# EAGLE design step_motor (EAGLE 6.5.0)

## Sheet 1 of 3: Encoder, connectors and supply
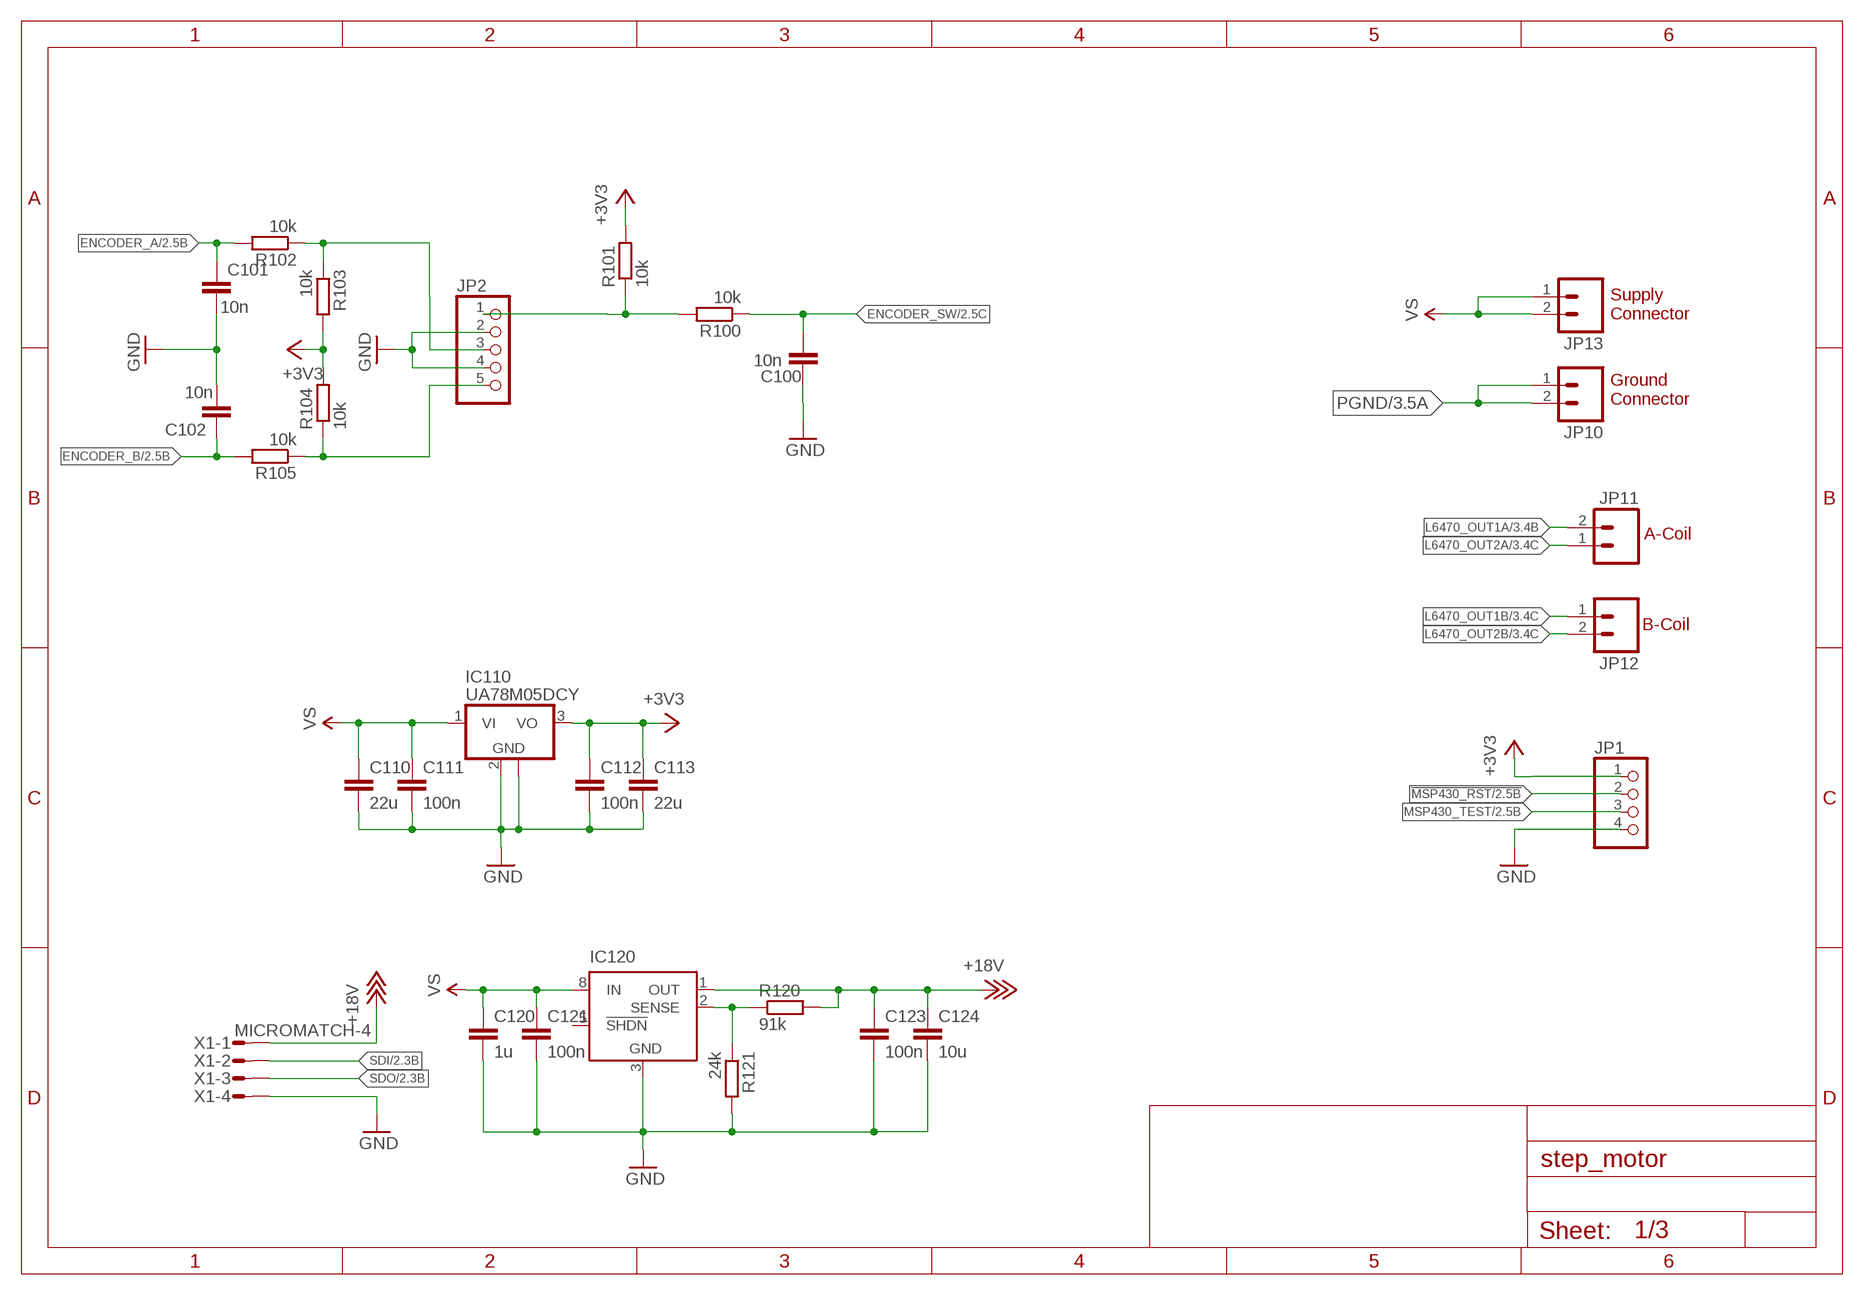
[diagram p0: schematic, sheet 1]

### Parts
C100  10n  C-EUC0603  [C0603]
C101  10n  C-EUC0603  [C0603]
C102  10n  C-EUC0603  [C0603]
C110  22u  C-EUC1206  [C1206]
C111  100n  C-EUC0603  [C0603]
C112  100n  C-EUC0603  [C0603]
C113  22u  C-EUC1206  [C1206]
C120  1u  C-EUC1206  [C1206]
C121  100n  C-EUC0603  [C0603]
C123  100n  C-EUC0603  [C0603]
C124  10u  C-EUC1206  [C1206]
IC110  UA78M05DCY  [SOT223]
IC120  LT1129CS8  [SOIC8]
JP1  PINHD-1X4  [1X04]
JP2  PINHD-1X5  [1X05]
JP10  M023.5MM  [SCREWTERMINAL-3.5MM-2]
JP11  M023.5MM  [SCREWTERMINAL-3.5MM-2]
JP12  M023.5MM  [SCREWTERMINAL-3.5MM-2]
JP13  M023.5MM  [SCREWTERMINAL-3.5MM-2]
R100  10k  R-EU_R0603  [R0603]
R101  10k  R-EU_R0603  [R0603]
R102  10k  R-EU_R0603  [R0603]
R103  10k  R-EU_R0603  [R0603]
R104  10k  R-EU_R0603  [R0603]
R105  10k  R-EU_R0603  [R0603]
R120  91k  R-EU_R0603  [R0603]
R121  24k  R-EU_R0603  [R0603]
X1  MICROMATCH-4  [MICROMATCH-4]

### Nets
!MSP430_RST: JP1.2 ; also sheet 2
+3V3: C112.1 C113.1 IC110.3(VO) JP1.1 R101.2 R103.2 R104.2 ; also sheet 2,3
+18V: C123.1 C124.1 IC120.1(OUT) R120.2 X1.1
ENCODER_A: C101.1 R102.2 ; also sheet 2
ENCODER_B: C102.1 R105.2 ; also sheet 2
ENCODER_SW: C100.2 R100.1 ; also sheet 2
GND: C100.1 C101.2 C102.2 C110.2 C111.2 C112.2 C113.2 C120.2 C121.2 C123.2 C124.2 IC110.2(GND) IC110.4(GND) IC120.3(GND) JP1.4 JP2.2 JP2.4 R121.2 X1.4 ; also sheet 2,3
L6470_OUT1A: JP11.2 ; also sheet 3
L6470_OUT1B: JP12.1 ; also sheet 3
L6470_OUT2A: JP11.1 ; also sheet 3
L6470_OUT2B: JP12.2 ; also sheet 3
MSP430_TEST: JP1.3 ; also sheet 2
N$2: IC120.2(SENSE) R120.1 R121.1
N$33: JP2.3 R102.1 R103.1
N$36: JP2.1 R100.2 R101.1
PGND: JP10.1 JP10.2 ; also sheet 3
R904: JP2.5 R104.1 R105.1
SDI: X1.2 ; also sheet 2
SDO: X1.3 ; also sheet 2
VS: C110.1 C111.1 C120.1 C121.1 IC110.1(VI) IC120.8(IN) JP13.1 JP13.2 ; also sheet 3
Unconnected: IC120.4(NC) IC120.5(!SHDN)

### Notes on the sheet
- Supply
  Connector
- Ground
  Connector
- A-Coil
- B-Coil

## Sheet 2 of 3: Mikrocontroller MSP430G2553
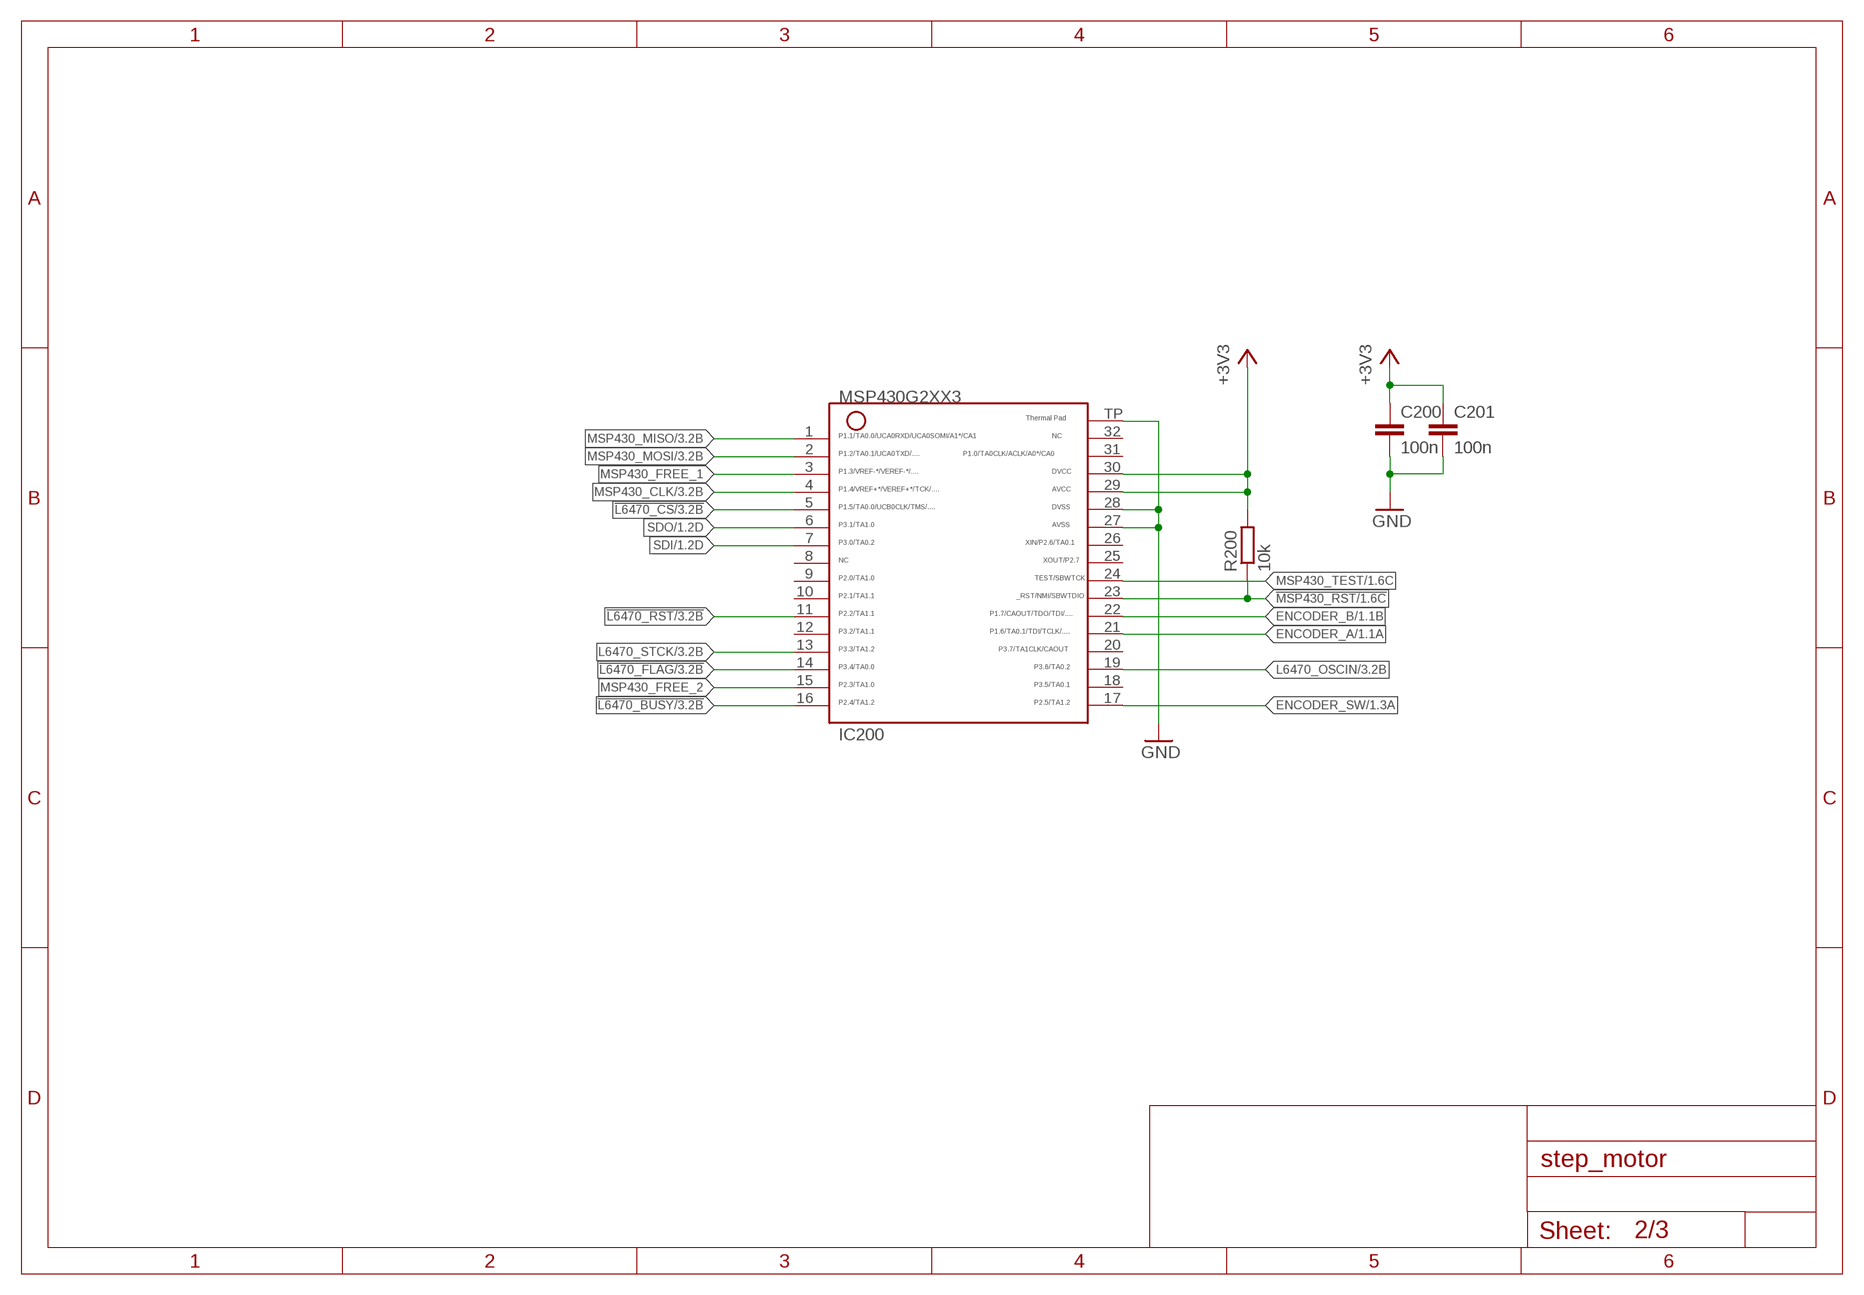
[diagram p1: schematic, sheet 2]

### Parts
C200  100n  C-EUC0603  [C0603]
C201  100n  C-EUC0603  [C0603]
IC200  G2XX3---RHB32  [RHB32]
R200  10k  R-EU_R0603  [R0603]

### Nets
!L6470_BUSY: IC200.16 ; also sheet 3
!L6470_CS: IC200.5 ; also sheet 3
!L6470_FLAG: IC200.14 ; also sheet 3
!L6470_RST: IC200.11 ; also sheet 3
!MSP430_RST: IC200.23 R200.1 ; also sheet 1
+3V3: C200.1 C201.1 IC200.29 IC200.30 R200.2 ; also sheet 1,3
ENCODER_A: IC200.21 ; also sheet 1
ENCODER_B: IC200.22 ; also sheet 1
ENCODER_SW: IC200.17 ; also sheet 1
GND: C200.2 C201.2 IC200.27 IC200.28 IC200.TP ; also sheet 1,3
L6470_OSCIN: IC200.19 ; also sheet 3
L6470_STCK: IC200.13 ; also sheet 3
MSP430_CLK: IC200.4 ; also sheet 3
MSP430_FREE_1: IC200.3
MSP430_FREE_2: IC200.15
MSP430_MISO: IC200.1 ; also sheet 3
MSP430_MOSI: IC200.2 ; also sheet 3
MSP430_TEST: IC200.24 ; also sheet 1
SDI: IC200.7 ; also sheet 1
SDO: IC200.6 ; also sheet 1
Unconnected: IC200.8 IC200.9 IC200.10 IC200.12 IC200.18 IC200.20 IC200.25 IC200.26 IC200.31 IC200.32

## Sheet 3 of 3: Step motor driver L6470 Datasheet <http://www.st.com/st-web-ui/static/active/en/resource/technical/document/datasheet/CD00255075.pdf>
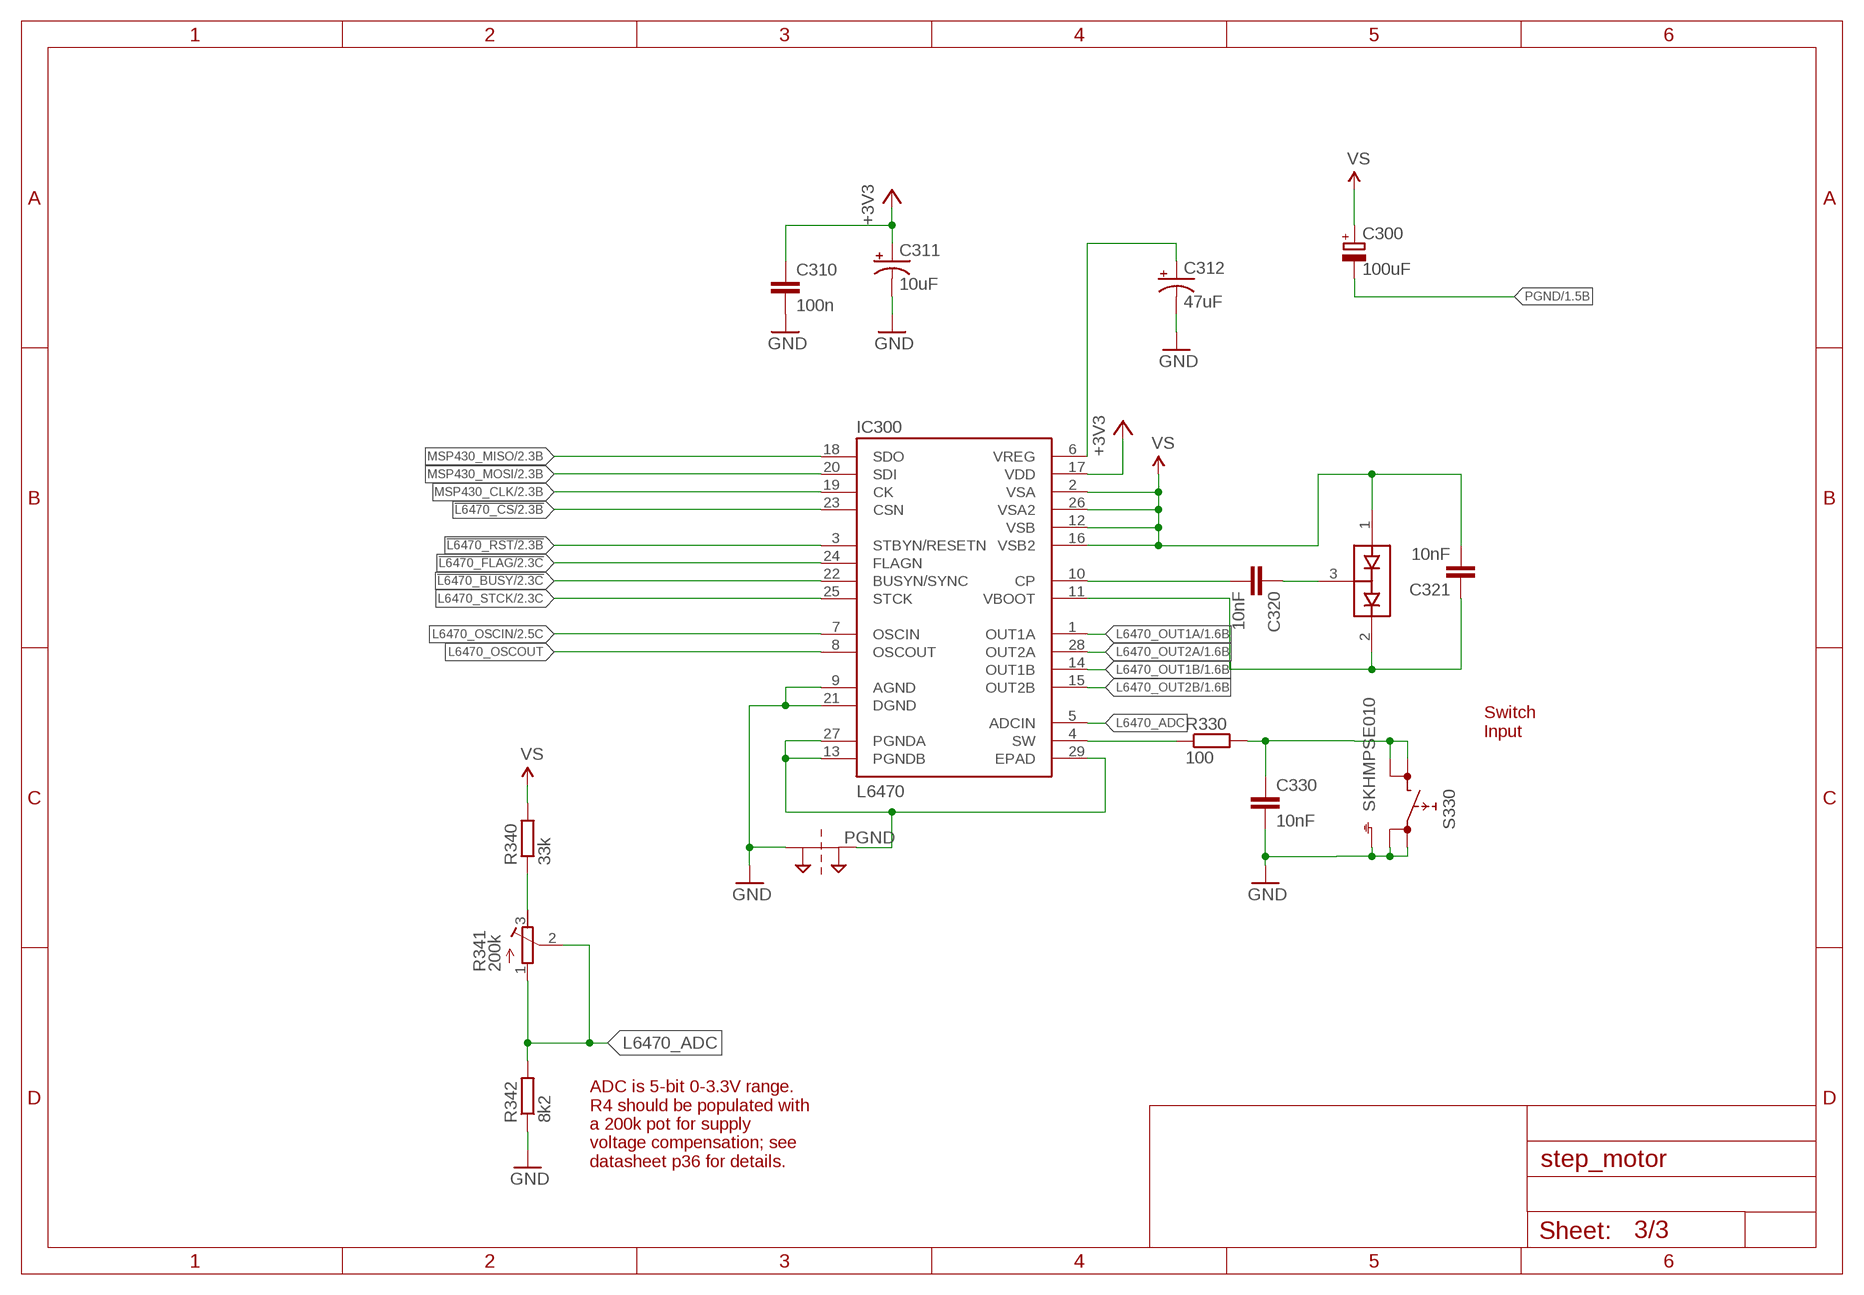
[diagram p2: schematic, sheet 3]

### Parts
C300  100uF  CPOL-EUD  [PANASONIC_D]
C310  100n  C-EUC0603  [C0603]
C311  10uF  10UF-TANT  [EIA3216]
C312  47uF  47UF-TANT  [EIA3528]
C320  10nF  C-EUC0603  [C0603]
C321  10nF  C-EUC0603  [C0603]
C330  10nF  C-EUC0603  [C0603]
D320  BAV99  [SOT23]
IC300  L6470  L6470  [HTSSOP28]
R330  100  R-EU_R0603  [R0603]
R340  33k  R-EU_R0603  [R0603]
R341  200k  R-TRIMM3224X  [RTRIM3224X]
R342  8k2  R-EU_R0603  [R0603]
S330  SKHMPSE010  [SKHMPXE010]
SJ2  2PT_GND_TIE  [2PT_GND_TIE]

### Nets
!L6470_BUSY: IC300.22(BUSYN/SYNC) ; also sheet 2
!L6470_CS: IC300.23(CSN) ; also sheet 2
!L6470_FLAG: IC300.24(FLAGN) ; also sheet 2
!L6470_RST: IC300.3(STBYN/RESETN) ; also sheet 2
+3V3: C310.1 C311.A(+) IC300.17(VDD) ; also sheet 1,2
C320: C320.2 IC300.10(CP)
GND: C310.2 C311.C(-) C312.C(-) C330.2 IC300.9(AGND) IC300.21(DGND) R342.1 S330.1(1.1) S330.2(1.2) S330.5(SH) SJ2.P$1 ; also sheet 1,2
L6470_ADC: IC300.5(ADCIN) R341.1(A) R341.2(S) R342.2
L6470_OSCIN: IC300.7(OSCIN) ; also sheet 2
L6470_OSCOUT: IC300.8(OSCOUT)
L6470_OUT1A: IC300.1(OUT1A) ; also sheet 1
L6470_OUT1B: IC300.14(OUT1B) ; also sheet 1
L6470_OUT2A: IC300.28(OUT2A) ; also sheet 1
L6470_OUT2B: IC300.15(OUT2B) ; also sheet 1
L6470_STCK: IC300.25(STCK) ; also sheet 2
MSP430_CLK: IC300.19(CK) ; also sheet 2
MSP430_MISO: IC300.18(SDO) ; also sheet 2
MSP430_MOSI: IC300.20(SDI) ; also sheet 2
N$1: C312.A(+) IC300.6(VREG)
N$5: IC300.4(SW) R330.1
N$6: C330.1 R330.2 S330.3(2.1) S330.4(2.2)
N$8: C320.1 D320.3(COM)
N$9: C321.1 D320.2(C2) IC300.11(VBOOT)
N$11: R340.1 R341.3(E)
PGND: C300.- IC300.13(PGNDB) IC300.27(PGNDA) IC300.29(EPAD) SJ2.P$2 ; also sheet 1
VS: C300.+ C321.2 D320.1(A1) IC300.2(VSA) IC300.12(VSB) IC300.16(VSB2) IC300.26(VSA2) R340.2 ; also sheet 1

### Notes on the sheet
- Switch
  Input
- ADC is 5-bit 0-3.3V range.
  R4 should be populated with
  a 200k pot for supply
  voltage compensation; see
  datasheet p36 for details.

## Power pins joined to a net without a drawn wire
GND: IC120.6(GND) IC120.7(GND)

## Library data of the parts
C100-C102 C110-C113 C120 C121 C123 C124 C200 C201 C310 C320 C321 C330 = rcl:C-EU: CAPACITOR, European symbol
C300 = rcl:CPOL-EU: POLARIZED CAPACITOR, European symbol
C311 = SparkFun-Capacitors:10UF-TANT: 10uF Tantalum SMT CAP-00811- 16V 10% (EIA-3216); PROD_ID: CAP-00811
C312 = SparkFun-Capacitors:47UF-TANT: 47uF Tantalum SMT CAP-08310- 10V 10% (EIA-3528); PROD_ID: CAP-08310
D320 = SparkFun-DiscreteSemi:BAV99: Two small signal silicon diodes connected anode to cathode. Connections to all three nodes available. DIO-10647; PROD_ID: DIO-10647
IC110 = linear:UA78M*: POSITIVE-VOLTAGE REGULATORS Source: http://focus.ti.com/lit/ds/symlink/ua78m33.pdf
IC120 = linear-technology:LT1129CS8: VOLTAGE REGULATOR with shutdown; MPN: LT1129CS8-5#PBF; OC_FARNELL: 1273576; OC_NEWARK: 57M2078
IC200 = TI_MSP430_v16:G2XX3---RHB32: MSP430G2XX1 QFN (RHB) 32 Pin Package
IC300 = SparkFun-PowerIC:L6470: 3A RMS/7A peak bipolar stepper motor driver with SPI control and step input in HTSSOP-28 package. IC-10648; PROD_ID: IC-10648
JP1 = pinhead:PINHD-1X4: PIN HEADER
JP2 = pinhead:PINHD-1X5: PIN HEADER
JP10-JP13 = SparkFun:M02: Header 2 Standard 2-pin 0.1" header. Use with straight break away headers (SKU : PRT-00116), right angle break away headers (PRT-00553), swiss pins (PRT-00743), machine pins (PRT-00117), and female headers (PRT-00115). Molex polarized connector foot print use with SKU : PRT-08233 with associated crimp pins and housings.
R100-R105 R120 R121 R200 R330 R340 R342 = rcl:R-EU_: RESISTOR, European symbol
R341 = rcl:R-TRIMM: Trimm resistor
S330 = switch:SKHMP*E010: 6.2 X 6.5mm TACT Switch (SMD) Source: http://www3.alps.co.jp/WebObjects/catalog.woa/PDF/E/Switch/Tact/SKHM/SKHM.PDF
SJ2 = SparkFun-Passives:2PT_GND_TIE: Package for connecting two ground nets in one place.
X1 = con-amp-micromatch:MICROMATCH-4: MicroMaTch 4 7-215464-4 / 0-215464-4 Drawing Number C-215464 DDEController.pdf; MPN: 7-215464-4; OC_FARNELL: 3784629; OC_NEWARK: 19R8124

## Board
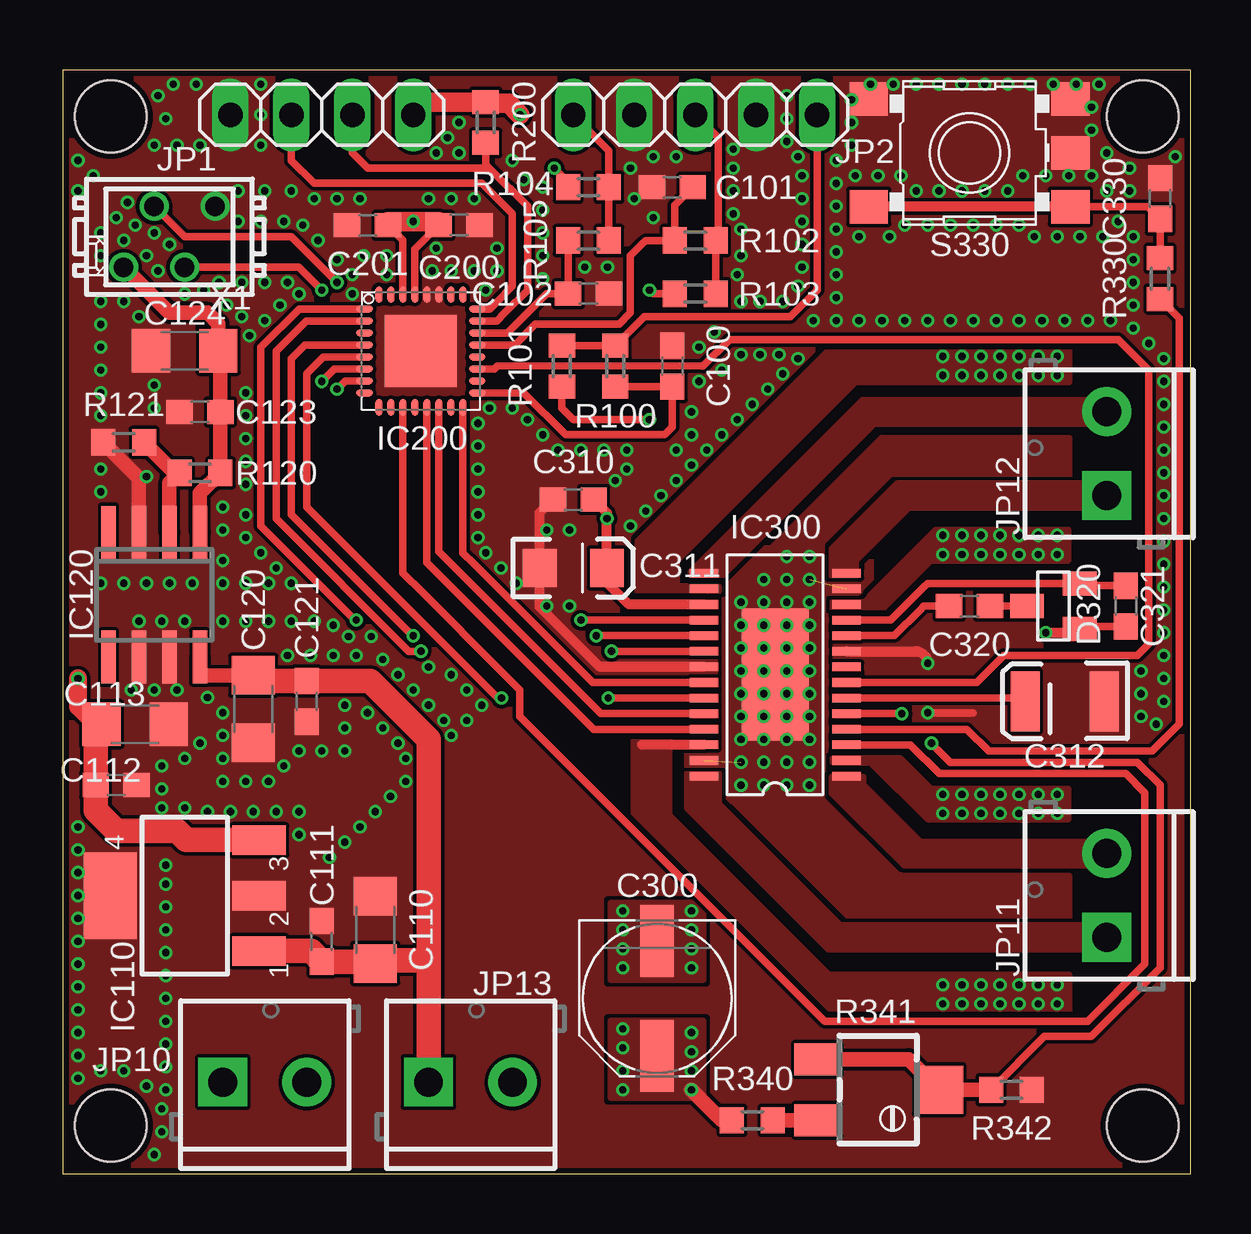
[diagram p3: board, top side]
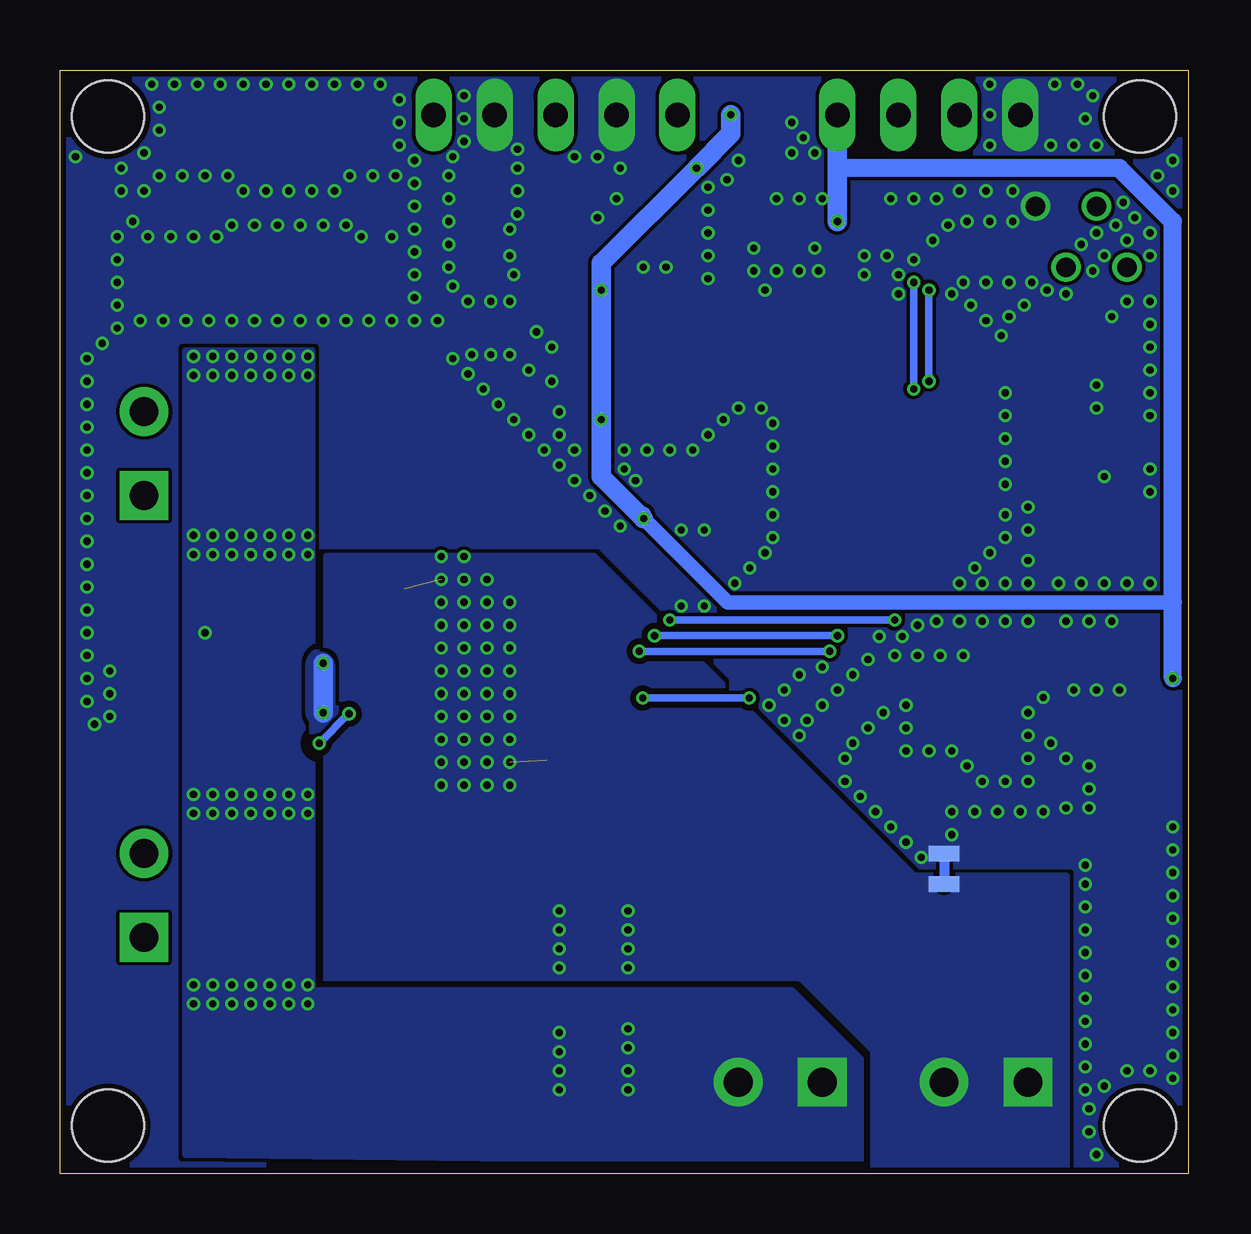
[diagram p4: board, bottom side, seen from below]

Size 47 x 46 mm. Coordinates in mm from the lower left corner, seen from the top.
Outline: 0,0 47,0 47,46 0,46 0,0
Copper layers (1*16): Top 0.018mm / dielectric 1.55mm / Bottom 0.018mm
Design rules "eC_2Layer_PClass6_BaseCopperO18_eCDefault *": minimum track width 0.15mm, minimum drill 0.3mm, track to track 0.15mm, track to pad 0.15mm, pad to pad 0.15mm, via to via 0.15mm, smd to smd 0mil, copper to edge 0.25mm, drill to drill 0.35mm, minimum pad ring 0.175mm, minimum via ring 0.125mm, stop-mask expansion 0mil, vias tented up to drill 0.45mm, thermal gap 0.2mm
Holes 3 mm at 45,44.06 45,2 2,44.06 2,2

### Footprints (pad centres in the part's own frame; a part is rotated, then mirrored left to right if it is on the bottom)
C0603 = smd 1.1 x 1: 1 -0.85,0; 2 0.85,0
C1206 = smd 1.6 x 1.8: 1 -1.4,0; 2 1.4,0
PANASONIC_D = smd 3 x 1.4: + 2.4,0; - -2.4,0
EIA3216 = smd 1.4 x 1.6: A 1.4,0; C -1.4,0
EIA3528 = smd 1.2 x 2.5: A 1.65,0; C -1.65,0
SOT23 = smd 1 x 1.4: 1 -0.95,-1.1; 2 0.95,-1.1; 3 0,1.1
SOT223 = smd 1.219 x 2.235: 1 -2.311,-3.099; 2 0,-3.099; 3 2.311,-3.099 | smd 3.6 x 2.2: 4 0,3.099
SOIC8 = smd 0.6 x 2.2: 1 -1.905,-2.6; 2 -0.635,-2.6; 3 0.635,-2.6; 4 1.905,-2.6; 5 1.905,2.6; 6 0.635,2.6; 7 -0.635,2.6; 8 -1.905,2.6
RHB32 = smd 0.7 x 0.3: 1 -2.35,1.75; 2 -2.35,1.25; 3 -2.35,0.75; 4 -2.35,0.25; 5 -2.35,-0.25; 6 -2.35,-0.75; 7 -2.35,-1.25; 8 -2.35,-1.75; 17 2.35,-1.75; 18 2.35,-1.25; 19 2.35,-0.75; 20 2.35,-0.25; 21 2.35,0.25; 22 2.35,0.75; 23 2.35,1.25; 24 2.35,1.75 | smd 0.3 x 0.7: 9 -1.75,-2.35; 10 -1.25,-2.35; 11 -0.75,-2.35; 12 -0.25,-2.35; 13 0.25,-2.35; 14 0.75,-2.35; 15 1.25,-2.35; 16 1.75,-2.35; 25 1.75,2.35; 26 1.25,2.35; 27 0.75,2.35; 28 0.25,2.35; 29 -0.25,2.35; 30 -0.75,2.35; 31 -1.25,2.35; 32 -1.75,2.35 | smd 3 x 3: TP 0,0
HTSSOP28 = smd 0.36 x 1.19: 1 -4.225,-2.97; 2 -3.575,-2.97; 3 -2.925,-2.97; 4 -2.275,-2.97; 5 -1.625,-2.97; 6 -0.975,-2.97; 7 -0.325,-2.97; 8 0.325,-2.97; 9 0.975,-2.97; 10 1.625,-2.97; 11 2.275,-2.97; 12 2.925,-2.97; 13 3.575,-2.97; 14 4.225,-2.97; 15 4.225,2.97; 16 3.575,2.97; 17 2.925,2.97; 18 2.275,2.97; 19 1.625,2.97; 20 0.975,2.97; 21 0.325,2.97; 22 -0.325,2.97; 23 -0.975,2.97; 24 -1.625,2.97; 25 -2.275,2.97; 26 -2.925,2.97; 27 -3.575,2.97; 28 -4.225,2.97 | smd 5.5 x 2.8: 29 0,0
1X04 = drill 1.016 long: 1 -3.81,0; 2 -1.27,0; 3 1.27,0; 4 3.81,0
1X05 = drill 1.016 long: 1 -5.08,0; 2 -2.54,0; 3 0,0; 4 2.54,0; 5 5.08,0
SCREWTERMINAL-3.5MM-2 = drill 1.2 pad 2.032 square: 1 0,0 | drill 1.2 pad 2.032: 2 3.5,0
R0603 = smd 1 x 1.1: 1 -0.85,0; 2 0.85,0
RTRIM3224X = smd 1.32 x 1.9: 1 -1.27,-2.54; 3 1.27,-2.54 | smd 2 x 2: 2 0,2.54
SKHMPXE010 = smd 1.6 x 1.4: 1 -4.2,2.25; 2 4.2,2.25; 3 -4.2,-2.25; 4 4.2,-2.25; 5 4.2,0
2PT_GND_TIE = smd 1.27 x 0.635: P$1 0,0.635; P$2 0,-0.635
MICROMATCH-4 = drill 0.813: 1 1.905,1.27; 2 0.635,-1.27; 3 -0.635,1.27; 4 -1.905,-1.27

### Placement (x,y rotation side)
C100  25.4,33.66 270 top
C101  25.4,41.12 180 top
C102  21.91,36.67 0 top
C110  13.02,10.16 90 top
C111  10.79,9.68 90 top
C112  2.22,16.19 0 top
C113  3.02,18.73 0 top
C120  7.94,19.37 270 top
C121  10.16,19.68 270 top
C123  5.71,31.75 180 top
C124  5.08,34.29 180 top
C200  16.51,39.53 0 top
C201  12.7,39.53 180 top
C300  24.77,7.3 270 top
C310  21.27,28.1 180 top
C311  21.27,25.24 0 top
C312  41.75,19.68 180 top
C320  37.78,23.65 180 top
C321  44.29,23.65 270 top
C330  45.72,40.64 90 top
D320  41.27,23.65 90 top
IC110  5.08,11.59 90 top
IC120  3.81,24.13 180 top
IC200  14.92,34.29 0 top
IC300  29.69,20.8 90 top
JP1  10.79,44.13 180 top
JP2  26.35,44.13 180 top
JP10  6.67,3.81 0 top
JP11  43.5,9.84 90 top
JP12  43.5,28.26 90 top
JP13  15.24,3.81 0 top
R100  23.02,33.66 90 top
R101  20.8,33.66 270 top
R102  26.35,38.89 180 top
R103  26.35,36.67 180 top
R104  21.91,41.12 180 top
R105  21.91,38.89 180 top
R120  5.71,29.21 0 top
R121  2.54,30.48 180 top
R200  17.62,43.81 90 top
R330  45.72,37.31 90 top
R340  28.73,2.22 180 top
R341  33.97,3.49 270 top
R342  39.53,3.49 180 top
S330  37.78,42.55 0 top
SJ2  10.16,12.7 0 bottom
X1  4.45,39.05 180 top

### Tracks (layer width: path | path; a pad name or v marks a point on that pad's centre or on a via)
!L6470_BUSY
  Top 0.305: IC300.22 22.07,20.47 17.14,25.4 16.67,25.87 IC200.16
!L6470_CS  (via drill 0.3)
  Top 0.305: IC300.23 v22.72,19.82 | IC200.5 10.86,34.04 10.16,33.34 10.16,27.78 18.12,19.82 v18.28,19.82
  Bottom 0.305: v22.72,19.82 v18.28,19.82
!L6470_FLAG
  Top 0.305: IC300.24 22.42,19.17 16.19,25.4 15.67,25.92 IC200.14
!L6470_RST
  Top 0.305: IC200.11 14.17,25.04 14.99,24.22 18.26,20.95 19.05,20.16 19.05,19.05 31.75,6.35 42.7,6.35 45.09,8.73 45.09,15.88 44.29,16.67 36.51,16.67 35.31,17.87 IC300.3
!MSP430_RST
  Top 0.305: JP1.2 12.06,42.55 12.7,41.91 17.78,41.91 | 17.78,41.91 19.37,40.32 19.37,36.83 18.41,35.88 18.08,35.54 IC200.23 | R200.1 17.62,42.07 17.78,41.91
+3V3  (via drill 0.3)
  Top 0.305: C201.1 14.17,38.91 IC200.30 | C200.1 14.67,38.54 IC200.29 | R104.2 20.95,41.22 20.95,41.43 v20.48,41.91 | v24.45,36.83 24.61,36.67 R103.2 | v24.45,31.43 21.27,31.43 20.95,31.75 20.8,31.91 R101.2
  Top 0.406: IC300.17 23.59,23.72 22.86,24.45 22.67,24.64 C311.A v22.67,27.3 22.67,27.55 C310.1
  Top 0.75: 1.37,18.73 0.64,19.47 v0.64,20.64
  Top 0.813: JP1.1 15.14,44.66 R200.2 17.68,44.61 18.57,44.61 v19.05,44.13 | C201.1 13.55,39.69 v14.61,39.69 15.66,39.69 C200.1
  Top 1.016: C113.1 1.37,18.73 C112.1 1.37,15.14 2.22,14.29 4.76,14.29 5.08,13.97 5.15,13.9 IC110.3
  Bottom 0.61: 0.64,23.81 19.18,23.81 v22.67,27.3 22.67,27.49
  Bottom 0.75: v0.64,20.64 0.64,23.81 0.64,39.69 2.86,41.91 14.61,41.91
  Bottom 0.813: JP1.1 14.61,41.91 v14.61,39.69 | 22.7,27.3 24.45,29.05 v24.45,31.43 v24.45,36.83 24.45,37.94 v20.48,41.91 19.05,43.34 v19.05,44.13
+18V
  Top 0.61: IC120.1 5.71,28.36 R120.2 C123.1 6.57,34.2 C124.1 6.48,35.43 6.03,35.88 4.45,35.88 X1.1
C320
  Top 0.305: IC300.10 34.65,22.42 35.72,23.5 35.88,23.65 C320.2
ENCODER_A
  Top 0.305: IC200.21 18.82,34.54 19.68,35.4 23.18,35.4 23.65,35.88 23.65,38.26 24.13,38.73 24.29,38.89 R102.2 25.5,40.37 C101.1
ENCODER_B
  Top 0.305: R105.2 C102.1 20.16,36.67 19.37,35.88 18.53,35.04 IC200.22
ENCODER_SW
  Top 0.305: IC200.17 19.21,32.54 20.95,30.8 25.08,30.8 25.4,31.11 C100.2 R100.1
GND  (via drill 0.3)
  Top 0.305: v36.04,19.21 37.94,19.21
  Top 0.406: IC300.21 22.38,21.12 20.32,23.18 19.87,23.62 C311.C 19.87,27.55 C310.2 | IC300.9 35.54,21.77 arc-90 v36.04,21.27
  Top 0.61: IC120.3 3.17,29 R121.2
  Bottom 0.813: v36.04,19.21 v36.04,21.27
  other vias: 23.65,26.99 24.29,27.62 24.92,28.26 25.56,28.89 26.19,29.53 26.83,30.16 27.46,30.8 28.1,31.43 28.73,32.07 29.37,32.7 30,33.34 30.64,33.97 29.84,34.13 29.05,34.13 28.26,34.13 27.46,33.5 26.51,33.02 26.19,31.75 31.27,35.56 17.62,36.83 18.1,37.62 18.1,38.58 15.4,37.62 16.19,37.62 17.14,37.62 15.56,38.58 17.14,40.64 16.19,40.64 15.24,40.64 12.38,40.64 11.43,40.64 11.43,38.1 12.06,36.67 12.06,37.47 13.49,37.47 13.49,38.26 12.54,38.26 21.75,37.78 22.7,37.78 11.11,13.18 11.75,13.81 12.38,14.45 13.02,15.08 13.65,15.72 14.29,16.35 14.29,17.3 13.97,17.94 13.34,18.57 12.7,19.21 11.75,19.53 11.75,18.57 11.75,17.62 10.79,17.62 9.84,17.62 9.21,16.99 8.57,16.35 7.62,16.35 6.67,16.35 6.67,17.3 6.67,18.26 6.67,19.21 6.03,19.84 9.84,14.13 9.84,15.08 8.89,15.08 7.94,15.08 6.99,15.08 6.03,15.08 5.08,15.24 4.13,15.24 4.13,16.03 4.13,16.99 5.08,17.3 5.71,17.94 2.86,20.16 3.81,20.16 4.76,20.16 0.64,14.45 0.64,13.49 0.64,12.54 0.64,11.59 0.64,10.64 0.64,9.68 0.64,8.73 0.64,7.78 6.67,23.02 7.62,23.02 8.57,23.02 9.53,23.02 10.48,23.02 6.67,24.61 7.62,24.61 8.57,24.61 9.53,24.61 5.08,23.02 4.13,23.02 3.17,23.02 5.4,24.61 4.45,24.61 3.49,24.61 2.54,24.61 1.59,24.61 1.59,28.42 1.59,29.37 1.59,31.59 1.59,32.54 1.59,33.5 1.59,34.45 1.59,35.4 1.59,36.35 2.54,36.35 3.17,35.72 3.81,32.86 3.81,31.91 3.49,29.05 6.67,25.56 6.67,26.83 6.67,27.78 7.62,28.73 7.62,29.69 7.62,30.64 7.62,31.59 7.62,32.54 7.78,34.92 8.41,35.56 9.05,36.2 9.84,36.67 9.37,37.15 8.41,37.15 7.46,37.15 6.51,37.15 5.87,36.83 6.83,36.2 7.46,35.72 5.08,36.67 8.89,25.24 8.26,25.88 7.62,26.51 7.62,27.46 26.19,30.8 25.56,30.16 23.5,30.16 22.54,30.16 21.59,30.16 20.64,30.16 20,30.8 19.37,31.43 18.73,31.91 17.78,31.91 17.3,31.27 17.3,30.32 17.3,29.37 17.3,28.42 17.3,27.46 17.3,26.51 17.62,25.88 18.26,25.24 18.89,24.61 20.16,23.65 21.11,23.65 21.11,26.83 20.16,26.83 23.02,28.89 23.5,29.37 3.97,37.62 4.45,38.73 3.81,39.21 3.49,38.26 2.54,38.89 1.59,38.26 1.59,39.21 2.22,39.85 3.02,39.53 2.7,40.48 10.64,38.89 10,39.53 10.48,40.64 9.53,40.96 9.21,39.69 8.26,39.69 7.3,39.69 7.3,40.96 8.41,40.96 20,37.31 20,38.26 20,39.21 20,40.16 20,41.12 18.73,42.23 19.21,41.43 24.61,39.85 23.81,40.64 23.65,41.91 24.61,42.39 27.15,35.08 26.51,34.45 32.23,35.56 33.18,35.56 34.13,35.56 35.08,35.56 36.04,35.56 36.99,35.56 37.94,35.56 38.89,35.56 39.85,35.56 40.8,35.56 41.75,35.56 42.7,35.56 43.66,35.56 44.61,35.24 45.24,34.61 45.88,33.97 45.88,33.02 45.88,32.07 45.88,31.11 45.88,30.16 45.88,29.21 45.88,28.26 45.88,27.3 45.88,26.35 45.88,25.4 45.88,24.45 45.88,23.5 45.88,22.54 45.88,21.59 45.88,20.64 45.88,19.68 45.56,18.73 44.93,20.95 44.93,20 44.93,19.05 32.23,36.51 32.23,37.47 32.23,38.42 32.23,39.37 32.23,40.32 32.23,41.27 32.23,42.23 32.86,42.86 32.86,43.81 32.86,44.77 44.61,36.2 44.61,37.15 44.61,38.1 44.61,39.05 43.97,39.69 43.34,39.05 42.39,39.05 41.43,39.05 40.48,39.05 39.85,39.53 38.89,39.53 37.94,39.53 36.99,39.53 36.04,39.53 35.08,39.53 34.45,39.05 33.18,39.05 46.35,42.39 44.45,40.96 44.45,41.91 43.5,42.55 42.86,43.5 42.86,44.45 43.18,45.4 42.23,45.4 41.27,45.4 40.32,45.4 39.37,45.4 38.42,45.4 37.47,45.4 36.51,45.4 35.56,45.4 34.61,45.4 33.66,45.4 33.02,41.59 33.97,41.59 34.92,41.59 35.56,40.96 36.51,40.96 37.47,40.96 38.42,40.96 39.37,40.96 40.01,41.59 40.96,41.59 41.91,41.59 42.86,41.59 43.5,40.96 16.19,18.26 16.83,18.89 17.46,19.53 15.88,18.89 15.24,19.53 14.61,20.16 13.97,20.8 13.34,21.43 9.37,21.59 10.32,21.59 11.27,21.59 12.22,21.59 11.27,22.86 11.91,22.38 12.86,22.38 16.83,20.16 16.19,20.8 15.24,21.11 0.64,6.83 0.64,5.87 0.64,4.92 0.64,3.97 1.59,4.29 2.54,4.29 3.49,3.65 4.13,2.7 4.13,1.75 3.81,0.79 4.29,3.49 4.29,4.45 4.29,5.4 4.29,6.35 4.29,7.3 4.29,8.26 4.29,9.21 4.29,10.16 4.29,11.11 4.29,12.06 4.29,12.86 0.64,40.96 1.27,41.59 0.64,42.23 3.81,42.86 4.29,43.97 3.97,44.93 4.6,45.4 5.56,45.4 4.76,42.86 5.71,42.86 8.26,45.4 8.26,44.13 8.26,42.86 15.56,42.55 16.51,42.55 16.51,43.81 16.03,43.18 25.56,42.39 28.26,36.35 29.05,36.35 30,36.35 30.64,36.99 30.8,37.78 30.8,38.73 30.8,39.69 30.8,40.64 30.8,41.59 30.64,42.39 28.1,37.47 28.26,38.26 28.26,39.37 27.94,40.01 27.94,40.96 27.94,41.91 30.16,43.02 30.16,43.97 30.16,44.93 27.94,42.7
  pour Bottom (rank 5, no thermals): 0,46.04 0,0 46.99,0 46.99,46.04
  pour Top (rank 5, no thermals): 46.99,46.04 46.99,0 0,0 0,46.04
L6470_ADC  (via drill 0.3)
  Top 0.305: IC300.5 v34.96,19.17 | v36.2,17.94 36.99,17.14 44.77,17.14 45.72,16.19 45.72,11.75 45.72,8.57 42.86,5.71 40.9,5.71 R342.2
  Top 0.61: R342.2 R341.2 35.24,4.76 R341.1
  Bottom 0.305: v34.96,19.17 v36.2,17.94
L6470_OSCIN
  Top 0.29: 26.67,33.66 18.1,33.66
  Top 0.305: 26.67,33.66 27.78,34.77 43.97,34.77 45.24,33.5 45.24,22.07 44.77,21.59 39.21,21.59 38.09,20.47 IC300.7 | 18.1,33.66 17.98,33.54 IC200.19
L6470_OUT1A
  pour Top (isolate 0.25, no thermals): 32.07,15.88 35.08,12.86 44.13,12.86 44.13,13.81 35.72,13.81 33.34,16.19 33.34,16.51 32.07,16.51
L6470_OUT1B
  pour Top (isolate 0.25, no thermals): 32.07,24.92 32.07,26.04 34.77,28.73 44.13,28.73 44.13,27.78 35.24,27.78 33.02,25.56 33.02,24.92
L6470_OUT2A
  pour Top (isolate 0.25, no thermals): 26.04,16.67 26.04,15.24 31.91,9.37 44.13,9.37 44.13,10.32 32.38,10.32 27.3,15.4 27.3,16.67
L6470_OUT2B
  pour Top (isolate 0.25, rank 2, no thermals): 26.19,24.92 26.19,25.08 33.34,32.23 44.13,32.23 44.13,31.27 33.81,31.27 27.46,24.92
L6470_STCK
  Top 0.305: IC300.25 22.12,18.52 16.19,24.45 15.17,25.47 IC200.13
MSP430_CLK  (via drill 0.3)
  Top 0.305: IC300.19 v22.23,22.42 | IC200.4 10.09,34.54 9.53,33.97 9.53,27.46 14.57,22.42 v14.61,22.42
  Bottom 0.305: v22.23,22.42 v14.61,22.42
MSP430_MISO  (via drill 0.3)
  Top 0.305: IC300.18 v21.59,23.07 | IC200.1 9.85,36.04 8.26,34.45 8.26,26.99 12.17,23.07 v12.22,23.07
  Bottom 0.305: v21.59,23.07 v12.22,23.07
MSP430_MOSI  (via drill 0.3)
  Top 0.305: IC300.20 v22.86,21.77 | IC200.2 10.14,35.54 8.89,34.29 8.89,27.3 14.42,21.77 v14.92,21.77
  Bottom 0.305: v22.86,21.77 v14.92,21.77
MSP430_TEST
  Top 0.305: JP1.3 9.53,42.23 10.48,41.27 17.46,41.27 18.73,40.01 18.73,36.99 18.1,36.35 17.78,36.04 IC200.24
N$1
  Top 0.305: IC300.6 40.1,19.82 C312.A
N$2
  Top 0.61: IC120.2 4.45,28.79 R120.1 4.66,29.21 R121.1
N$5
  Top 0.305: IC300.4 37.36,18.52 37.68,18.52 38.58,17.62 45.4,17.62 46.51,18.73 46.51,35.66 R330.1
N$6
  Top 0.305: R330.2 C330.1 45.22,40.3 S330.4
  Top 0.406: S330.4 S330.3
N$8
  Top 0.305: D320.3 C320.1
N$9
  Top 0.305: IC300.11 34.5,23.07 35.88,24.45 36.03,24.6 D320.2 | 42.6,24.6 42.7,24.5 C321.1
  Top 0.406: D320.2 42.6,24.6
N$11
  Top 0.61: R340.1 R341.3
N$33
  Top 0.305: R103.1 R102.1 27.3,39 27.3,41.59 27.3,43.18 JP2.3
N$36
  Top 0.305: R101.1 R100.2 24.23,35.72 30.32,35.72 31.43,36.83 31.43,40.01 31.43,40.64 31.43,42.23 31.43,43.18 JP2.1
PGND  (via drill 0.3)  (2 unrouted)
  other vias: 29.21,22.86 28.26,22.86 28.26,21.91 30.16,19.05 29.21,17.14 30.16,24.77 30.16,22.86 30.16,18.1 30.16,17.14 30.16,16.19 31.11,18.1 31.11,19.05 31.11,23.81 29.21,21.91 31.11,22.86 31.11,24.77 29.21,16.19 31.11,17.14 29.21,24.77 23.34,8.57 23.34,10.95 23.34,10.16 30.16,21.91 31.11,21.91 28.26,18.1 29.21,18.1 29.21,19.05 28.26,19.05 28.26,17.14 28.26,16.19 23.34,9.37 26.19,8.57 26.19,9.37 26.19,10.95 26.19,10.16 28.26,20.95 28.26,20 28.26,23.81 29.21,20.95 30.16,20.95 31.11,20.95 31.11,20 29.21,20 30.16,20 29.21,23.81 30.16,23.81 31.11,16.19 30.16,25.72 31.11,25.72
  pour Bottom (isolate 0.25, rank 2, no thermals): 5.08,12.38 5.08,0.32 13.65,0.32 13.65,5.08 16.51,7.94 35.88,8.1 35.88,25.72 24.77,25.72 11.43,12.38
  pour Top (rank 2, no thermals): 22.86,11.27 22.86,8.1 26.67,8.1 26.67,11.27
  pour Top (rank 4, no thermals): 26.04,26.04 26.04,15.56 33.66,15.56 33.66,26.04
  pour Top (rank 2): 41.91,30.64 41.91,28.89 34.61,28.89 31.75,26.04 31.75,15.56 34.92,12.38 41.91,12.38 41.91,10.48 33.02,10.48 27.94,15.56 27.94,24.45 34.13,30.64
R904
  Top 0.305: R105.1 R104.1 22.76,42.65 21.3,44.1 JP2.5
SDI  (via drill 0.3)
  Top 0.305: IC200.7 11.77,33.04 v11.43,32.7 | X1.2 5.08,39.05 8.26,39.05 9.53,39.05 v11.43,37.15
  Bottom 0.305: v11.43,32.7 11.43,36.2 v11.43,37.15
SDO  (via drill 0.3)
  Top 0.305: IC200.6 11.31,33.54 v10.79,33.02 | X1.3 9.84,37.78 v10.79,36.83
  Bottom 0.305: v10.79,33.02 v10.79,36.83
VS  (via drill 0.3)
  Top 0.305: 42.6,22.7 42.7,22.8 C321.2
  Top 0.406: IC300.26 24.13,17.87 | 42.6,22.7 D320.1 42.21,22.54 v40.96,22.54
  Top 0.61: IC120.8 5.71,20.77 C120.1 | R340.2 27.46,2.22 v26.19,3.49
  Top 1.016: JP13.1 15.24,8.89 | 15.24,8.89 15.24,18.1 13.34,20 12.8,20.54 C121.1 7.94,20.54 C120.1 | 15.24,8.89 13.15,8.89 C110.1 12.94,8.83 C111.1 10.35,9.28 IC110.1
  other vias: 23.34,6.03 23.34,4.29 23.34,3.49 23.34,5.24 38.26,15.01 36.67,15.81 39.05,26.6 39.05,25.81 26.19,4.29 26.19,5.08 26.19,5.87 39.85,26.6 38.26,25.81 36.67,25.81 37.47,26.6 37.47,25.81 38.26,26.6 39.85,25.81 36.67,26.6 37.47,15.01 36.67,15.01 37.47,15.81 40.64,15.01 39.05,15.81 38.26,15.81 39.85,15.01 39.05,15.01 39.85,15.81 41.43,15.01 40.64,15.81 41.43,15.81 39.85,7.87 36.67,7.87 36.67,7.08 39.85,7.08 39.05,7.87 39.05,7.08 38.26,7.08 41.43,7.87 38.26,7.87 37.47,7.08 37.47,7.87 41.43,7.08 40.64,7.08 40.64,7.87 38.26,33.27 39.05,33.27 39.85,34.06 40.64,34.06 39.05,34.06 39.85,33.27 36.67,34.06 37.47,34.06 36.67,33.27 38.26,34.06 37.47,33.27 40.64,33.27 41.43,33.27 41.43,34.06 40.64,26.6 40.64,25.81 41.43,25.81 41.43,26.6
  pour Top (isolate 0.25, no thermals): 32.07,17.3 32.07,17.14 33.66,17.14 36.04,14.76 41.91,14.76 41.91,16.03 36.2,16.03 34.92,17.3
  pour Top (isolate 0.25, no thermals): 32.07,23.81 32.07,23.5 34.13,23.5 36.2,25.56 41.91,25.56 41.91,26.83 36.35,26.83 33.34,23.81
  pour Bottom (isolate 0.5, no thermals): 13.65,4.76 13.65,0.48 41.75,0.79 41.75,34.29 36.51,34.29 36.51,7.62 16.51,7.62
  pour Top (no thermals): 22.86,6.35 22.86,3.17 26.67,3.17 26.67,6.35
  pour Top (isolate 0.25, no thermals): 41.91,34.29 41.91,33.02 33.02,33.02 25.56,25.56 25.56,24.45 27.3,24.45 27.3,24.29 23.97,24.29 23.97,26.35 31.91,34.29
  pour Top (isolate 0.25, no thermals): 23.81,18.1 23.81,14.61 31.75,6.67 41.91,6.67 41.91,8.26 31.91,8.26 25.24,14.92 25.24,18.1